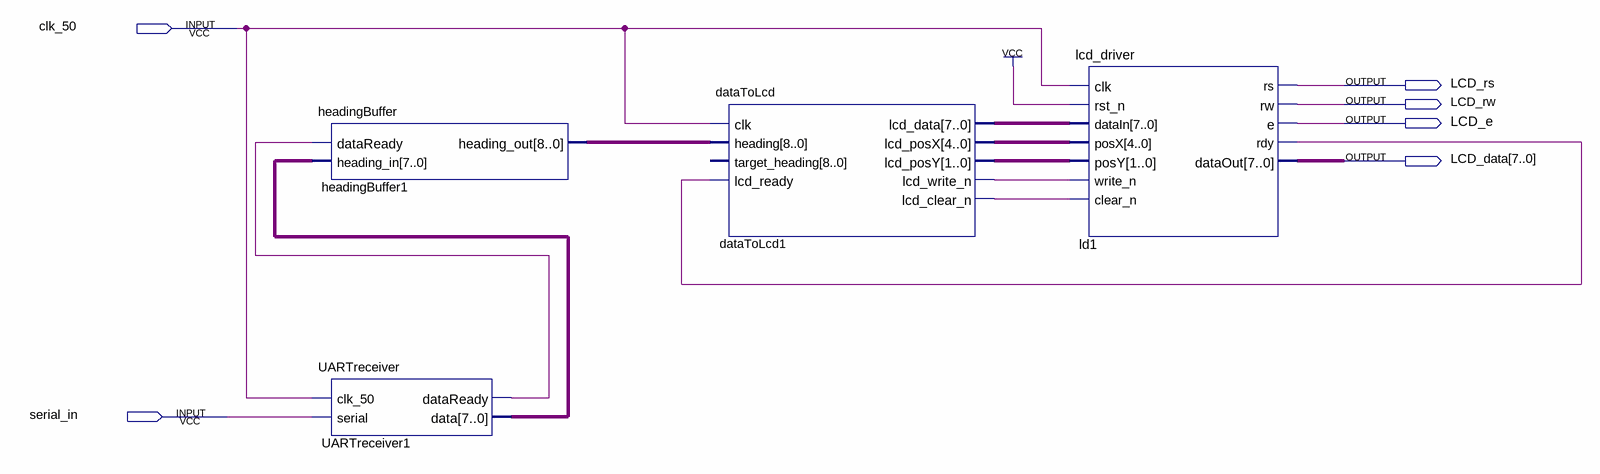
[diagram p0: schematic sheet]
// Quartus schematic DebugBlock.bdf as structural Verilog: 4 symbols, 6 pins
module DebugBlock (
  input  clk_50,
  input  serial_in,
  output LCD_rs,
  output LCD_rw,
  output LCD_e,
  output [7:0] LCD_data
);

  wire dataToLcd1_lcd_clear_n, dataToLcd1_lcd_write_n, ld1_rdy, UARTreceiver1_dataready;
  wire [1:0] dataToLcd1_lcd_posy;
  wire [4:0] dataToLcd1_lcd_posx;
  wire [7:0] dataToLcd1_lcd_data, UARTreceiver1_data;
  wire [8:0] headingBuffer1_heading_out;

  headingBuffer headingBuffer1 (
    .dataReady(UARTreceiver1_dataready), .heading_in(UARTreceiver1_data),
    .heading_out(headingBuffer1_heading_out));
  UARTreceiver UARTreceiver1 (
    .clk_50(clk_50), .serial(serial_in), .dataReady(UARTreceiver1_dataready), .data(UARTreceiver1_data));
  dataToLcd dataToLcd1 (
    .clk(clk_50), .heading(headingBuffer1_heading_out), .lcd_ready(ld1_rdy), .lcd_data(dataToLcd1_lcd_data),
    .lcd_posX(dataToLcd1_lcd_posx), .lcd_posY(dataToLcd1_lcd_posy), .lcd_write_n(dataToLcd1_lcd_write_n),
    .lcd_clear_n(dataToLcd1_lcd_clear_n));  // open: target_heading
  lcd_driver ld1 (
    .clk(clk_50), .rst_n(1'b1), .dataIn(dataToLcd1_lcd_data), .posX(dataToLcd1_lcd_posx),
    .posY(dataToLcd1_lcd_posy), .write_n(dataToLcd1_lcd_write_n), .clear_n(dataToLcd1_lcd_clear_n),
    .rs(LCD_rs), .rw(LCD_rw), .e(LCD_e), .rdy(ld1_rdy), .dataOut(LCD_data));
endmodule
